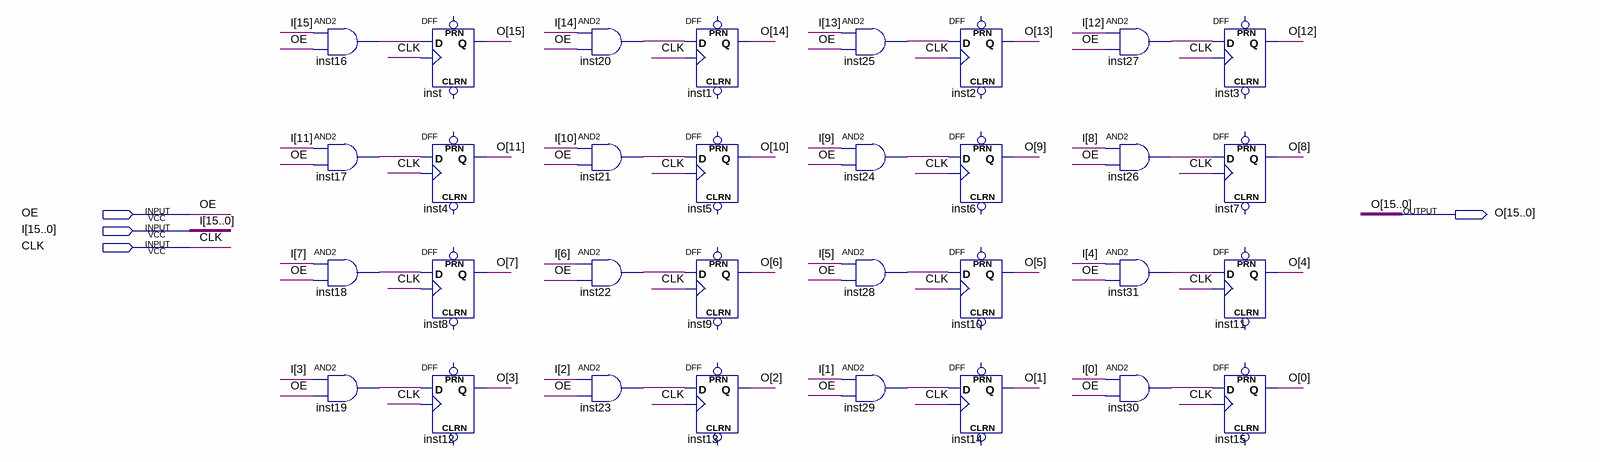
[diagram p0: schematic sheet]
// Quartus schematic dff16bit.bdf as structural Verilog: 32 symbols, 4 pins
module dff16bit (
  input  OE,
  input  [15:0] I,
  input  CLK,
  output [15:0] O
);

  wire inst16_out, inst17_out, inst18_out, inst19_out, inst20_out, inst21_out, inst22_out, inst23_out,
       inst24_out, inst25_out, inst26_out, inst27_out, inst28_out, inst29_out, inst30_out, inst31_out;

  and inst16 (inst16_out, I[15], OE);
  and inst17 (inst17_out, I[11], OE);
  and inst18 (inst18_out, I[7], OE);
  and inst19 (inst19_out, I[3], OE);
  DFF inst (.CLK(CLK), .D(inst16_out), .Q(O[15]));  // open: CLRN, PRN
  DFF inst4 (.CLK(CLK), .D(inst17_out), .Q(O[11]));  // open: CLRN, PRN
  DFF inst8 (.CLK(CLK), .D(inst18_out), .Q(O[7]));  // open: CLRN, PRN
  DFF inst12 (.CLK(CLK), .D(inst19_out), .Q(O[3]));  // open: CLRN, PRN
  and inst20 (inst20_out, I[14], OE);
  and inst21 (inst21_out, I[10], OE);
  and inst22 (inst22_out, I[6], OE);
  and inst23 (inst23_out, I[2], OE);
  DFF inst1 (.CLK(CLK), .D(inst20_out), .Q(O[14]));  // open: CLRN, PRN
  DFF inst5 (.CLK(CLK), .D(inst21_out), .Q(O[10]));  // open: CLRN, PRN
  DFF inst9 (.CLK(CLK), .D(inst22_out), .Q(O[6]));  // open: CLRN, PRN
  DFF inst13 (.CLK(CLK), .D(inst23_out), .Q(O[2]));  // open: CLRN, PRN
  and inst25 (inst25_out, I[13], OE);
  and inst24 (inst24_out, I[9], OE);
  and inst28 (inst28_out, I[5], OE);
  and inst29 (inst29_out, I[1], OE);
  DFF inst2 (.CLK(CLK), .D(inst25_out), .Q(O[13]));  // open: CLRN, PRN
  DFF inst6 (.CLK(CLK), .D(inst24_out), .Q(O[9]));  // open: CLRN, PRN
  DFF inst10 (.CLK(CLK), .D(inst28_out), .Q(O[5]));  // open: CLRN, PRN
  DFF inst14 (.CLK(CLK), .D(inst29_out), .Q(O[1]));  // open: CLRN, PRN
  and inst27 (inst27_out, I[12], OE);
  and inst26 (inst26_out, I[8], OE);
  and inst31 (inst31_out, I[4], OE);
  and inst30 (inst30_out, I[0], OE);
  DFF inst3 (.CLK(CLK), .D(inst27_out), .Q(O[12]));  // open: CLRN, PRN
  DFF inst7 (.CLK(CLK), .D(inst26_out), .Q(O[8]));  // open: CLRN, PRN
  DFF inst11 (.CLK(CLK), .D(inst31_out), .Q(O[4]));  // open: CLRN, PRN
  DFF inst15 (.CLK(CLK), .D(inst30_out), .Q(O[0]));  // open: CLRN, PRN
endmodule
